# EAGLE design Suino board (EAGLE 7.4.0)
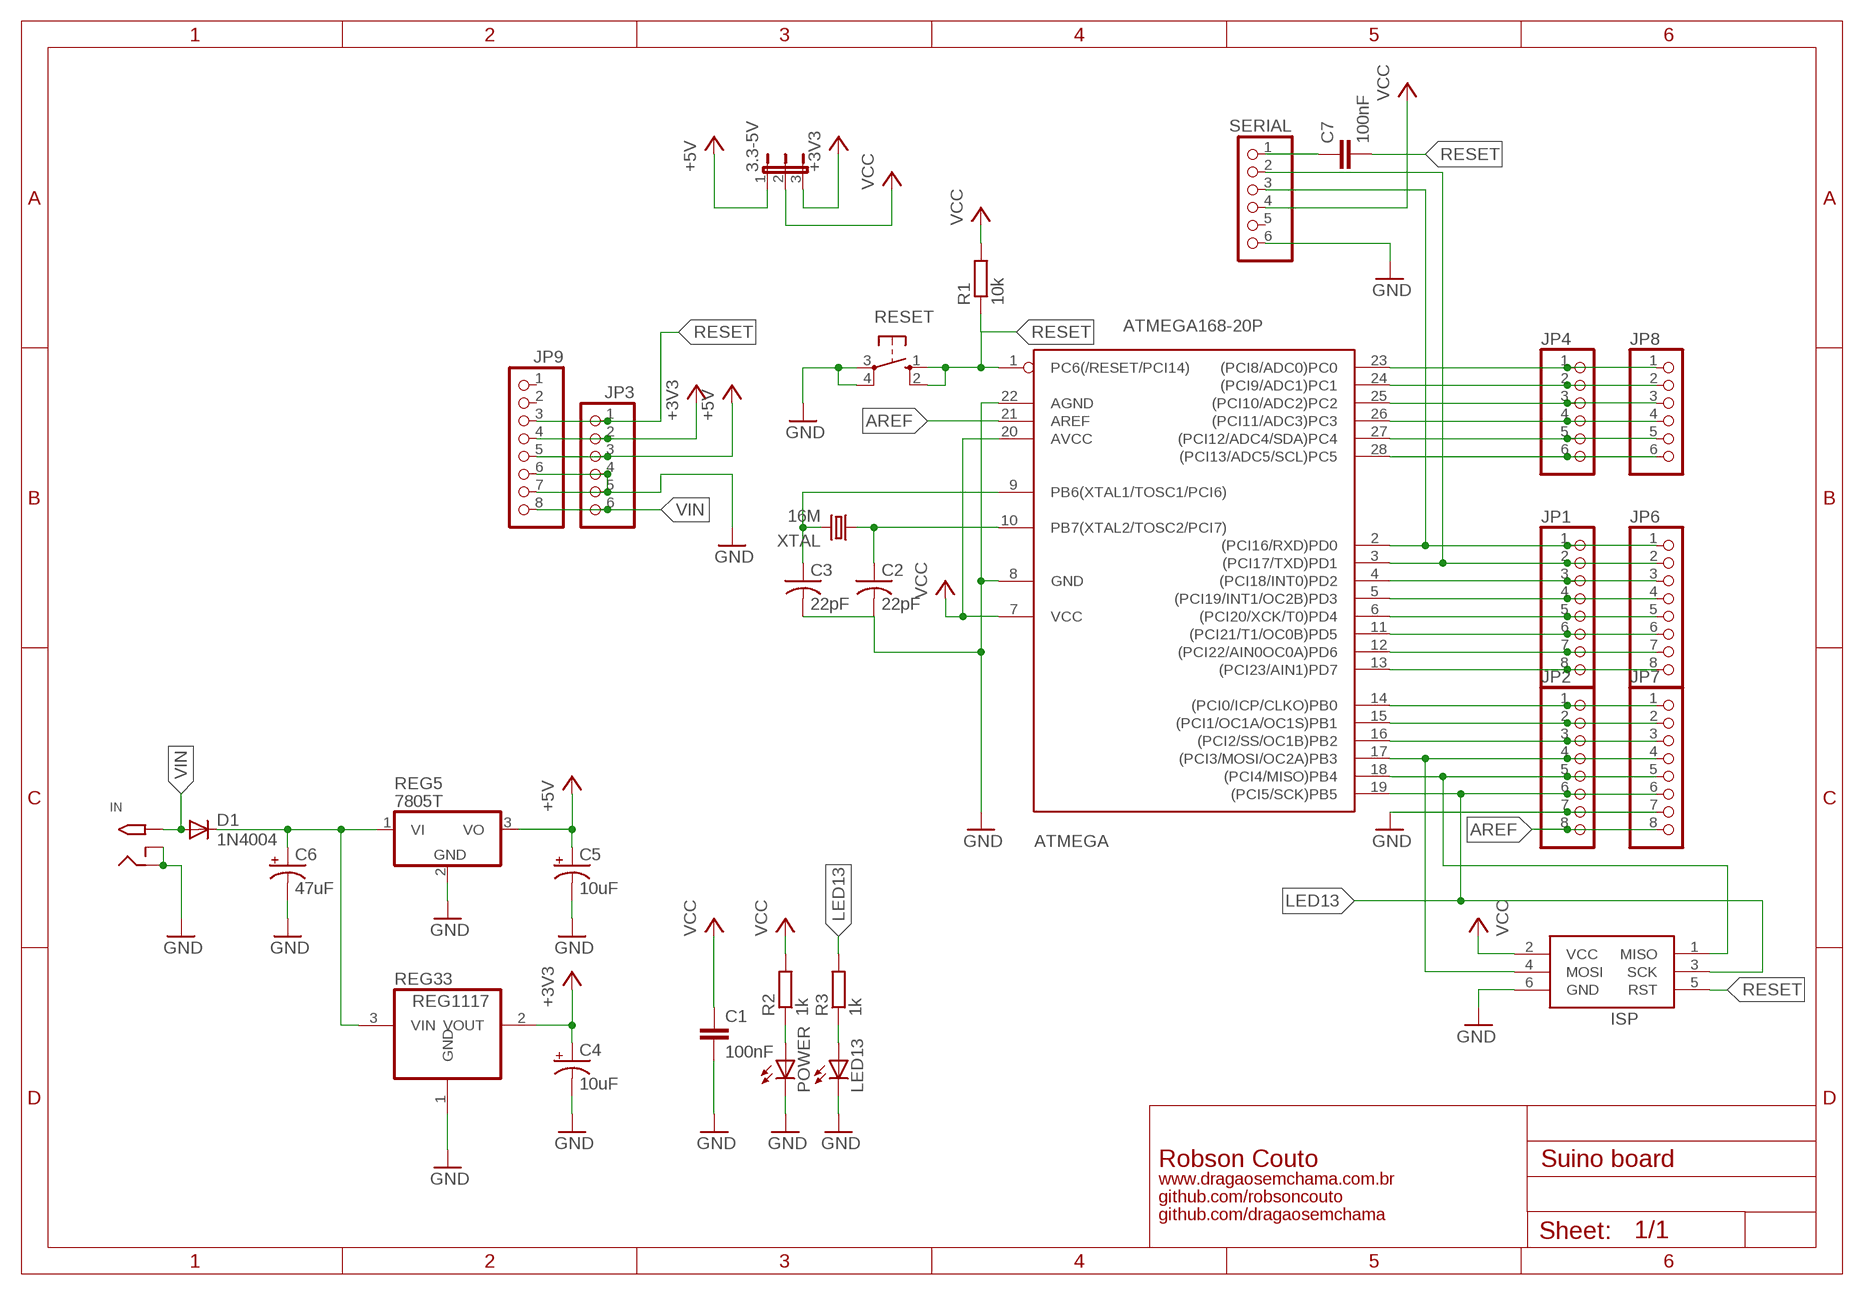
[diagram p0: schematic, sheet 1]

## Parts
3.3-5V  JP2E  [JP2]
ATMEGA  ATMEGA168-20P  [DIL28-3]
C1  100nF  C-EU050-025X075  [C050-025X075]
C2  22pF  C-US025-030X050  [C025-030X050]
C3  22pF  C-US025-030X050  [C025-030X050]
C4  10uF  CPOL-USE2.5-5  [E2,5-5]
C5  10uF  CPOL-USE2.5-5  [E2,5-5]
C6  47uF  CPOL-USE2.5-6  [E2,5-6]
C7  100nF  C-EU050-025X075  [C050-025X075]
D1  1N4004  [DO41-10]
IN  2.1MMJACKTHM  [PJ-102A]
ISP  AVRISP-6  [AVRISP]
JP1  PINHD-1X8BIG  [1X08-BIG]
JP2  PINHD-1X8BIG  [1X08-BIG]
JP3  PINHD-1X6B  [1X06-BIG]
JP4  PINHD-1X6B  [1X06-BIG]
JP6  PINHD-1X8BIG  [1X08-BIG]
JP7  PINHD-1X8BIG  [1X08-BIG]
JP8  PINHD-1X6B  [1X06-BIG]
JP9  PINHD-1X8BIG  [1X08-BIG]
LED13  LED3MM  [LED3MM]
POWER  LED3MM  [LED3MM]
R1  10k  R-EU_0207/7  [0207/7]
R2  1k  R-EU_0207/7  [0207/7]
R3  1k  R-EU_0207/7  [0207/7]
REG5  7805T  [TO220H]
REG33  REG1117  [SOT223]
RESET  10-XX  [B3F-10XX]
SERIAL  PINHD-1X6  [1X06]
XTAL  16M  CRYSTALHC49S  [HC49/S]

## Nets
+3V3: 3.3-5V.3 C4.+ JP3.2 JP9.4 REG33.2(VOUT)
+5V: 3.3-5V.1 C5.+ JP3.3 JP9.5 REG5.3(VO)
AREF: ATMEGA.21(AREF) JP2.8 JP7.8
GND: ATMEGA.8(GND) ATMEGA.22(AGND) C1.2 C2.2 C3.2 C4.- C5.- C6.- IN.RING IN.RING_SW ISP.6(GND) JP2.7 JP3.4 JP3.5 JP7.7 JP9.6 JP9.7 LED13.K(C) POWER.K(C) REG5.2(GND) REG33.1(GND) RESET.3(P) RESET.4(P1) SERIAL.6
LED13: ATMEGA.19((PCI5/SCK)PB5) ISP.3(SCK) JP2.6 JP7.6 R3.2
N$1: C7.1 SERIAL.1
N$2: ATMEGA.9(PB6(XTAL1/TOSC1/PCI6)) C3.1 XTAL.2
N$3: ATMEGA.10(PB7(XTAL2/TOSC2/PCI7)) C2.1 XTAL.1
N$5: POWER.A R2.1
N$6: LED13.A R3.1
N$7: ATMEGA.23((PCI8/ADC0)PC0) JP4.1 JP8.1
N$8: ATMEGA.24((PCI9/ADC1)PC1) JP4.2 JP8.2
N$9: ATMEGA.25((PCI10/ADC2)PC2) JP4.3 JP8.3
N$10: ATMEGA.26((PCI11/ADC3)PC3) JP4.4 JP8.4
N$11: ATMEGA.27((PCI12/ADC4/SDA)PC4) JP4.5 JP8.5
N$12: ATMEGA.28((PCI13/ADC5/SCL)PC5) JP4.6 JP8.6
N$13: ATMEGA.2((PCI16/RXD)PD0) JP1.1 JP6.1 SERIAL.3
N$14: ATMEGA.3((PCI17/TXD)PD1) JP1.2 JP6.2 SERIAL.2
N$15: ATMEGA.4((PCI18/INT0)PD2) JP1.3 JP6.3
N$16: ATMEGA.5((PCI19/INT1/OC2B)PD3) JP1.4 JP6.4
N$17: ATMEGA.6((PCI20/XCK/T0)PD4) JP1.5 JP6.5
N$18: ATMEGA.11((PCI21/T1/OC0B)PD5) JP1.6 JP6.6
N$19: ATMEGA.12((PCI22/AIN0OC0A)PD6) JP1.7 JP6.7
N$20: ATMEGA.13((PCI23/AIN1)PD7) JP1.8 JP6.8
N$21: ATMEGA.14((PCI0/ICP/CLKO)PB0) JP2.1 JP7.1
N$22: ATMEGA.15((PCI1/OC1A/OC1S)PB1) JP2.2 JP7.2
N$23: ATMEGA.16((PCI2/SS/OC1B)PB2) JP2.3 JP7.3
N$24: ATMEGA.17((PCI3/MOSI/OC2A)PB3) ISP.4(MOSI) JP2.4 JP7.4
N$25: ATMEGA.18((PCI4/MISO)PB4) ISP.1(MISO) JP2.5 JP7.5
RESET: ATMEGA.1(PC6(/RESET/PCI14)) C7.2 ISP.5(RST) JP3.1 JP9.3 R1.1 RESET.1(S) RESET.2(S1)
VCC: 3.3-5V.2 ATMEGA.7(VCC) ATMEGA.20(AVCC) C1.1 ISP.2(VCC) R1.2 R2.2 SERIAL.4
VD: C6.+ D1.C REG5.1(VI) REG33.3(VIN)
VIN: D1.A IN.TIP JP3.6 JP9.8
Unconnected: JP9.1 JP9.2 SERIAL.5

## Notes on the sheet
- Robson Couto
- www.dragaosemchama.com.br
- github.com/robsoncouto
- github.com/dragaosemchama

## Library data of the parts
3.3-5V = jumper:JP2E: JUMPER
ATMEGA = adafruit:ATMEGA168*P: MICROCONTROLLER 16 kBytes FLASH 1 kBytes SRAM 512 Bytes EEPROM USART 8-channel 10 bit ADC
C1 C7 = resistor:C-EU: CAPACITOR, European symbol
C2 C3 = adafruit:C-US: CAPACITOR, American symbol
C4-C6 = resistor:CPOL-US: POLARIZED CAPACITOR, American symbol
D1 = diode:1N4004: DIODE general purpose rectifier, 1 A
IN = adafruit:2.1MMJACK: 2.1mm x 5.5mm THM DC jack with internal switch. Digikey part #PJ-102A, 4UCON part #05537 2.1mm x 5.5mm SMT DC jack with internal switch. Digikey part #PJ-002A-SMT, 4UCON part #03267 By microbuilder.eu & adafruit.com
ISP = adafruit:AVRISP: AVR ISP HEADER Standard 6 pin header for AVR programming
JP1 JP2 JP6 JP7 JP9 = adafruit:PINHD-1X8: PIN HEADER
JP3 JP4 JP8 SERIAL = adafruit:PINHD-1X6: PIN HEADER
LED13 POWER = adafruit:LED: LED OSRAM: - CHIPLED LG R971, LG N971, LY N971, LG Q971, LY Q971, LO R971, LY R971 LH N974, LH R974 LS Q976, LO Q976, LY Q976 LO Q996 - Hyper CHIPLED LW Q18S LB Q993, LB Q99A, LB R99A - SideLED LS A670, LO A670, LY A670, LG A670, LP A670 LB A673, LV A673, LT A673, LW A673 LH A674 LY A675 LS A676, LA A676, LO A676, LY A676, LW A676 LS A679, LY A679, LG A679 - Hyper Micro SIDELED® LS Y876, LA Y876, LO Y876, LY Y876 LT Y87S - SmartLED LW L88C, LW L88S LB L89C, LB L89S, LG L890 LS L89K, LO L89K, LY L89K LS L896, LA L896, LO L896, LY L896 - TOPLED LS T670, LO T670, LY T670, LG T670, LP T670 LSG T670, LSP T670, LSY T670, LOP T670, LYG T670 LG T671, LOG T671, LSG T671 LB T673, LV T673, LT T673, LW T673 LH T674 LS T676, LA T676, LO T676, LY T676, LB T676, LH T676, LSB T676, LW T676 LB T67C, LV T67C, LT T67C, LS T67K, LO T67K, LY T67K, LW E67C LS E67B, LA E67B, LO E67B, LY E67B, LB E67C, LV E67C, LT E67C LW T67C LS T679, LY T679, LG T679 LS T770, LO T770, LY T770, LG T770, LP T770 LB T773, LV T773, LT T773, LW T773 LH T774 LS E675, LA E675, LY E675, LS T675 LS T776, LA T776, LO T776, LY T776, LB T776 LHGB T686 LT T68C, LB T68C - Hyper Mini TOPLED® LB M676 - Mini TOPLED Santana® LG M470 LS M47K, LO M47K, LY M47K Source: http://www.osram.convergy.de/
R1-R3 = rcl:R-EU_: RESISTOR, European symbol
REG5 = adafruit:78*: Positive VOLTAGE REGULATOR Added bigger pads to the TO-92 package
REG33 = burr-brown:REG1117: 800mA and 1A Low Dropout (LDO) Positive Regulator 1.8V, 2.5V, 2.85V, 3.3V, 5V, and Adj; MPN: REG1117; OC_FARNELL: 1097566; OC_NEWARK: 14P6981
RESET = switch-omron:10-XX: OMRON SWITCH; MPN: B3F-1000; OC_FARNELL: 176432; OC_NEWARK: 36M3542
XTAL = adafruit:CRYSTAL: CRYSTAL; OC_FARNELL: 1667008; OC_NEWARK: unknown

## Board
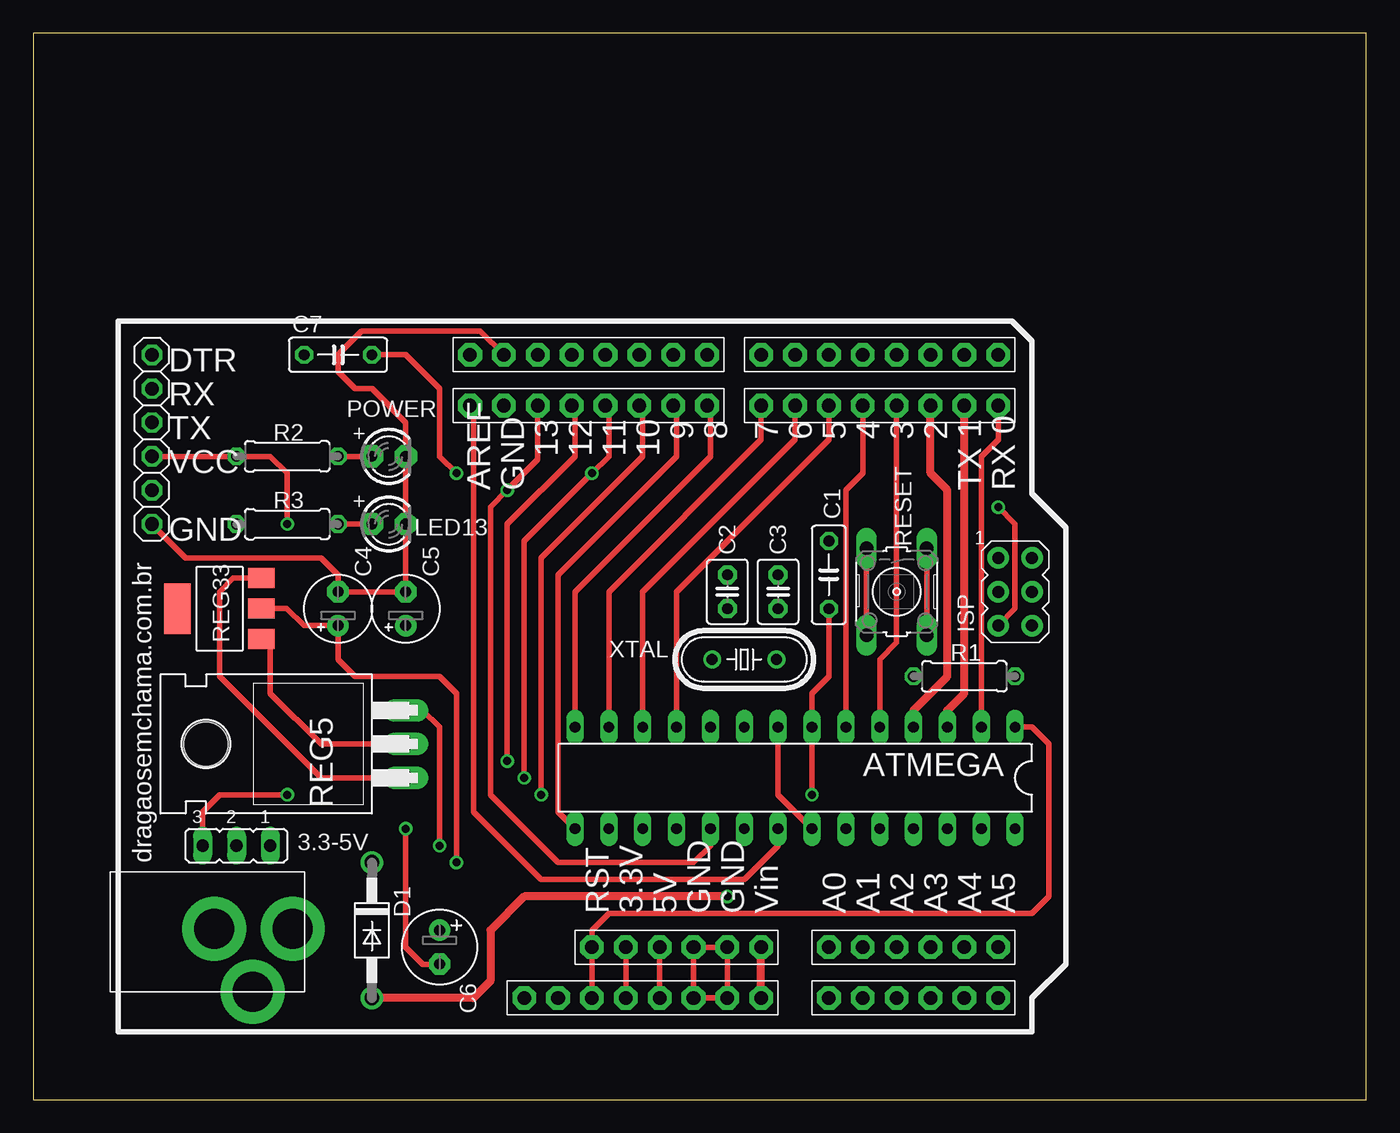
[diagram p1: board, top side]
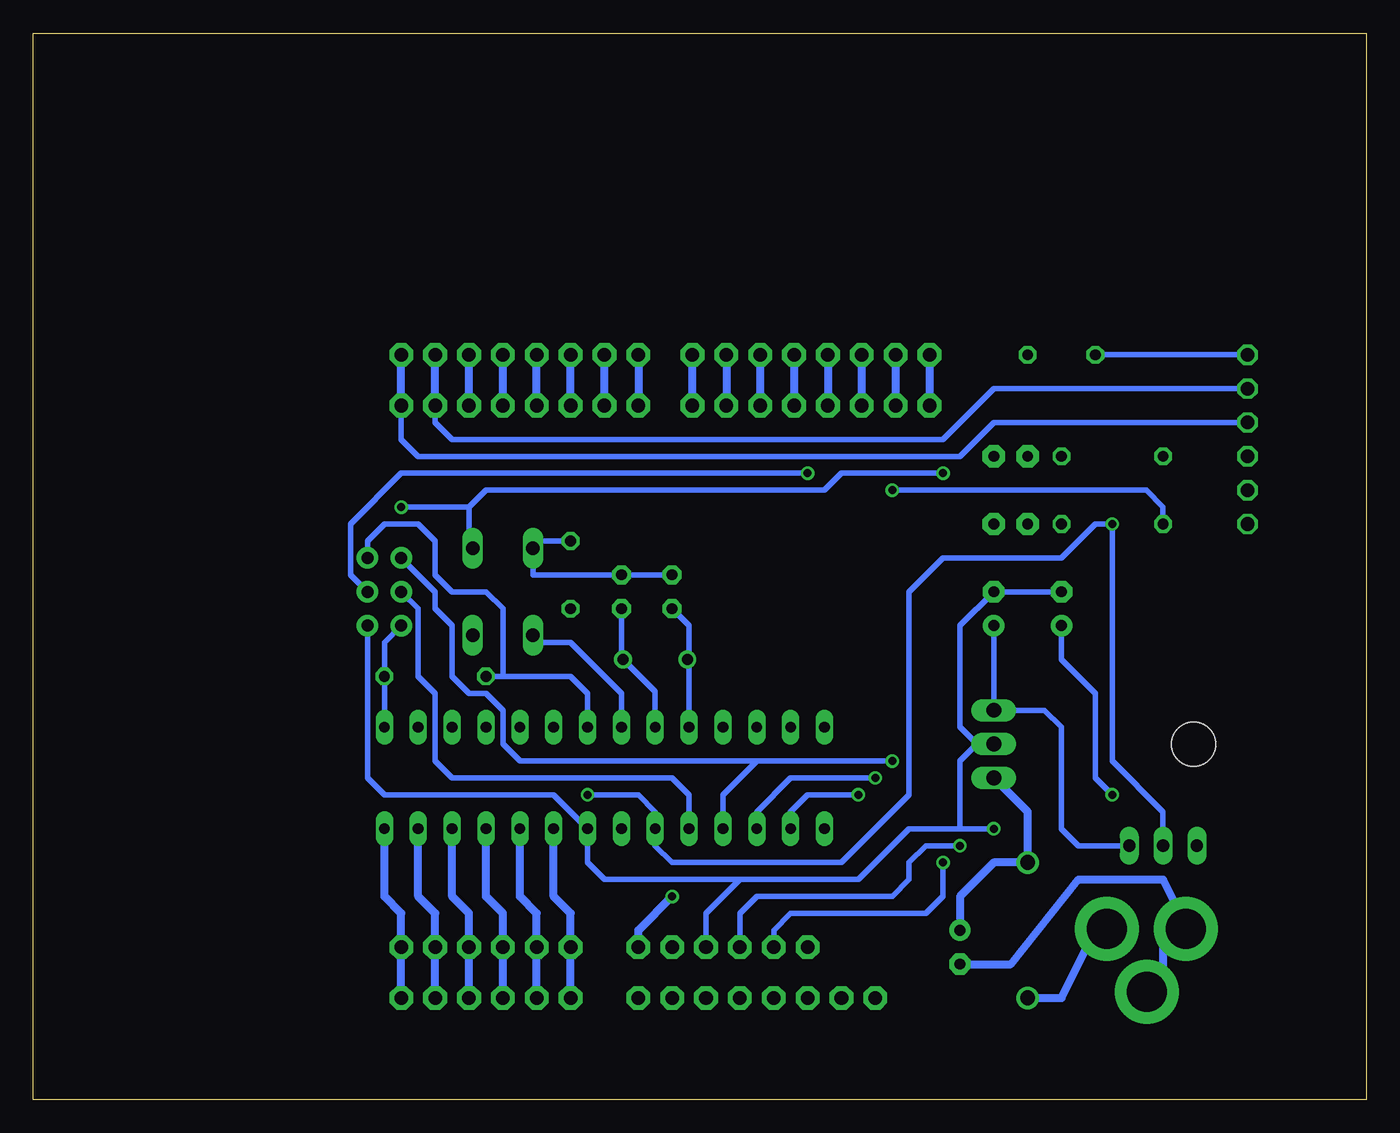
[diagram p2: board, bottom side, seen from below]

Size 100 x 80 mm. Coordinates in mm from the lower left corner, seen from the top.
Outline: 0,0 100,0 100,80 0,80 0,0
Copper layers (1*16): Top 0.035mm / dielectric 1.5mm / Bottom 0.035mm
Design rules "default *": minimum track width 10mil, minimum drill 16mil, track to track 8mil, track to pad 8mil, pad to pad 8mil, via to via 8mil, smd to smd 8mil, copper to edge 40mil, drill to drill 8mil, minimum pad ring 10mil, minimum via ring 8mil, stop-mask expansion 4mil, vias tented up to drill 0mil, thermal gap 10mil

### Footprints (pad centres in the part's own frame; a part is rotated, then mirrored left to right if it is on the bottom)
JP2 = drill 0.914 long: 1 -2.54,0; 2 0,0; 3 2.54,0
DIL28-3 = drill 0.813 long: 1 -16.51,-3.81; 2 -13.97,-3.81; 3 -11.43,-3.81; 4 -8.89,-3.81; 5 -6.35,-3.81; 6 -3.81,-3.81; 7 -1.27,-3.81; 8 1.27,-3.81; 9 3.81,-3.81; 10 6.35,-3.81; 11 8.89,-3.81; 12 11.43,-3.81; 13 13.97,-3.81; 14 16.51,-3.81; 15 16.51,3.81; 16 13.97,3.81; 17 11.43,3.81; 18 8.89,3.81; 19 6.35,3.81; 20 3.81,3.81; 21 1.27,3.81; 22 -1.27,3.81; 23 -3.81,3.81; 24 -6.35,3.81; 25 -8.89,3.81; 26 -11.43,3.81; 27 -13.97,3.81; 28 -16.51,3.81
C050-025X075 = drill 0.813 octagon: 1 -2.54,0; 2 2.54,0
C025-030X050 = drill 0.813 pad 1.422 octagon: 1 -1.27,0; 2 1.27,0
E2,5-5 = drill 0.813 pad 1.6: + -1.27,0 | drill 0.813 pad 1.6 octagon: - 1.27,0
E2,5-6 = drill 0.813 pad 1.6: + -1.27,0 | drill 0.813 pad 1.6 octagon: - 1.27,0
DO41-10 = drill 1.118: A 5.08,0; C -5.08,0
PJ-102A = drill 3 pad 4.8: RING 0.1,-3.39; RING_SW -4.6,-6.29; TIP 0.1,-9.29
AVRISP = drill 0.9 pad 1.626: 1 -1.27,2.54; 2 1.27,2.54; 3 -1.27,0; 4 1.27,0; 5 -1.27,-2.54; 6 1.27,-2.54
1X08-BIG = drill 1.016 pad 1.778 octagon: 1 -8.89,0; 2 -6.35,0; 3 -3.81,0; 4 -1.27,0; 5 1.27,0; 6 3.81,0; 7 6.35,0; 8 8.89,0
1X06-BIG = drill 1.016 pad 1.778 octagon: 1 -6.35,0; 2 -3.81,0; 3 -1.27,0; 4 1.27,0; 5 3.81,0; 6 6.35,0
LED3MM = drill 0.813 pad 1.676 octagon: A -1.27,0; K 1.27,0
0207/7 = drill 0.813 octagon: 1 -3.81,0; 2 3.81,0
TO220H = drill 1.118 long: 1 -2.54,-10.16; 2 0,-10.16; 3 2.54,-10.16 | hole 3.302: 0,4.826
SOT223 = smd 1.499 x 2.007: 1 -2.261,-3.15; 2 0.025,-3.15; 3 2.311,-3.15 | smd 3.81 x 2.007: 4 0,3.15
B3F-10XX = drill 1.016 long: 1 -3.251,2.261; 2 3.251,2.261; 3 -3.251,-2.261; 4 3.251,-2.261
1X06 = drill 1.016 octagon: 1 -6.35,0; 2 -3.81,0; 3 -1.27,0; 4 1.27,0; 5 3.81,0; 6 6.35,0
HC49/S = drill 0.813: 1 -2.413,0; 2 2.413,0

### Placement (x,y rotation side)
3.3-5V  15.24,19.05 180 top
ATMEGA  57.15,24.13 180 top
C1  59.69,39.37 90 top
C2  52.07,38.1 90 top
C3  55.88,38.1 90 top
C4  22.86,36.83 90 top
C5  27.94,36.83 90 top
C6  30.48,11.43 270 top
C7  22.86,55.88 0 top
D1  25.4,12.7 270 top
IN  10.16,12.7 90 top
ISP  73.66,38.1 0 top
JP1  63.5,55.88 180 top
JP2  41.66,55.88 180 top
JP3  48.26,11.43 0 top
JP4  66.04,11.43 0 top
JP6  63.5,52.07 180 top
JP7  41.66,52.07 180 top
JP8  66.04,7.62 0 top
JP9  45.72,7.62 0 top
LED13  26.67,43.18 0 top
POWER  26.67,48.26 0 top
R1  69.85,31.75 180 top
R2  19.05,48.26 180 top
R3  19.05,43.18 180 top
REG5  17.78,26.67 90 top
REG33  13.97,36.83 90 top
RESET  64.77,38.1 270 top
SERIAL  8.89,49.53 270 top
XTAL  53.34,33.02 0 top

### Tracks (layer width: path | path; a pad name or v marks a point on that pad's centre or on a via)
+3V3  (via drill 0.6)
  Top 0.406: JP9.4 JP3.2 | v31.75,17.78 31.75,30.48 30.48,31.75 24.13,31.75 22.86,33.02 C4.+ 20.32,35.56 19.02,36.85 REG33.2 | 3.3-5V.3 12.7,21.59 13.97,22.86 v19.05,22.86
  Bottom 0.406: JP3.2 44.45,12.7 43.18,13.97 33.02,13.97 31.75,15.24 v31.75,17.78 | v19.05,22.86 20.32,24.13 20.32,30.48 22.86,33.02 C4.+
+5V  (via drill 0.6)
  Top 0.406: JP9.5 JP3.3 | v30.48,19.05 30.48,27.94 29.21,29.21 REG5.3
  Bottom 0.406: C5.+ REG5.3 24.13,29.21 22.86,27.94 22.86,20.32 21.59,19.05 3.3-5V.1 | JP3.3 46.99,13.97 45.72,15.24 35.56,15.24 34.29,16.51 34.29,17.78 33.02,19.05 v30.48,19.05
AREF
  Top 0.406: ATMEGA.21 55.88,19.05 53.34,16.51 38.1,16.51 33.02,21.59 33.02,51.82 JP7.8
  Bottom 0.61: JP2.8 JP7.8
GND  (via drill 0.6)
  Top 0.406: SERIAL.6 11.43,40.64 21.59,40.64 22.86,39.37 C4.- C5.- LED13.K POWER.K 27.94,50.8 25.4,53.34 24.13,53.34 22.86,54.61 22.86,55.88 24.64,57.66 33.53,57.66 JP2.7 | RESET.4 RESET.3 | ATMEGA.8 55.88,22.86 ATMEGA.22 | v27.94,20.32 27.94,11.43 29.21,10.16 C6.- | REG5.2 21.59,26.67 17.78,30.48 17.78,33.91 REG33.1 | JP9.7 JP3.5 JP3.4 JP9.6 JP9.7
  Bottom 0.406: C2.2 C3.2 62.51,39.37 RESET.3 61.95,41.91 C1.2 | ISP.6 74.93,24.13 73.66,22.86 60.96,22.86 ATMEGA.22 58.42,17.78 57.15,16.51 46.99,16.51 | JP3.4 49.53,13.97 46.99,16.51 | 46.99,16.51 38.1,16.51 34.29,20.32 30.48,20.32 | REG5.2 29.21,26.67 | 29.21,26.67 30.48,25.4 30.48,20.32 | C4.- C5.- 30.48,35.56 30.48,27.94 29.21,26.67 | ATMEGA.8 55.88,30.48 59.69,34.29 61.95,34.29 RESET.4 | 30.48,20.32 v27.94,20.32
  Bottom 0.61: JP2.7 JP7.7 | IN.RING_SW 15.24,8.89 15.24,12.7 IN.RING 13.97,13.97 15.24,16.51 21.59,16.51 26.67,10.16 C6.-
LED13  (via drill 0.6)
  Top 0.406: JP7.6 37.85,48.01 v35.56,45.72 34.29,44.45 34.29,22.86 39.37,17.78 49.53,17.78 50.8,19.05 ATMEGA.19
  Bottom 0.406: v35.56,45.72 16.51,45.72 15.24,44.45 R3.2 | ISP.3 71.12,36.83 71.12,31.75 69.85,30.48 69.85,25.4 68.58,24.13 52.07,24.13 50.8,22.86 ATMEGA.19
  Bottom 0.61: JP7.6 JP2.6
N$1
  Bottom 0.406: SERIAL.1 C7.1
N$2
  Bottom 0.406: ATMEGA.9 53.34,30.61 XTAL.2 55.88,33.15 C3.1
N$3
  Bottom 0.406: ATMEGA.10 50.8,32.89 XTAL.1 50.8,33.02 50.8,35.56 C2.1
N$5
  Top 0.406: R2.1 POWER.A
N$6
  Top 0.406: LED13.A R3.1
N$7
  Bottom 0.61: JP8.1 JP4.1 59.69,13.97 60.96,15.24 ATMEGA.23
N$8
  Bottom 0.61: JP8.2 JP4.2 62.23,13.97 63.5,15.24 ATMEGA.24
N$9
  Bottom 0.61: JP8.3 JP4.3 64.77,13.97 66.04,15.24 ATMEGA.25
N$10
  Bottom 0.61: JP8.4 JP4.4 67.31,13.97 68.58,15.24 ATMEGA.26
N$11
  Bottom 0.61: JP8.5 JP4.5 69.85,13.97 71.12,15.24 ATMEGA.27
N$12
  Bottom 0.61: JP8.6 JP4.6 72.39,13.97 73.66,15.24 ATMEGA.28
N$13
  Top 0.406: ATMEGA.2 71.12,48.26 72.39,49.53 JP6.1
  Bottom 0.406: SERIAL.3 27.94,50.8 30.48,48.26 71.12,48.26 72.39,49.53 JP6.1
  Bottom 0.61: JP6.1 JP1.1
N$14
  Top 0.61: ATMEGA.3 68.58,29.21 69.85,30.48 JP6.2
  Bottom 0.406: SERIAL.2 27.94,53.34 31.75,49.53 68.58,49.53 69.85,50.8 JP6.2
  Bottom 0.61: JP6.2 JP1.2
N$15
  Top 0.61: ATMEGA.4 66.04,29.21 68.58,31.75 68.58,45.72 67.31,46.99 JP6.3
  Bottom 0.61: JP6.3 JP1.3
N$16
  Top 0.406: ATMEGA.5 63.5,33.02 64.77,34.29 JP6.4
  Bottom 0.61: JP6.4 JP1.4
N$17
  Top 0.406: JP6.5 62.23,46.99 60.96,45.72 ATMEGA.6
  Bottom 0.61: JP6.5 JP1.5
N$18
  Top 0.406: ATMEGA.11 48.26,38.1 59.69,49.53 JP6.6
  Bottom 0.61: JP6.6 JP1.6
N$19
  Top 0.406: ATMEGA.12 45.72,38.1 57.15,49.53 JP6.7
  Bottom 0.61: JP6.7 JP1.7
N$20
  Top 0.406: ATMEGA.13 43.18,38.1 54.61,49.53 JP6.8
  Bottom 0.61: JP1.8 JP6.8
N$21
  Top 0.406: ATMEGA.14 40.64,38.1 50.8,48.26 50.8,51.82 JP7.1
  Bottom 0.61: JP7.1 JP2.1
N$22
  Top 0.406: ATMEGA.15 39.37,21.59 39.37,39.37 48.26,48.26 48.26,51.82 JP7.2
  Bottom 0.61: JP2.2 JP7.2
N$23  (via drill 0.6)
  Top 0.406: v38.1,22.86 38.1,40.64 45.72,48.26 45.72,51.82 JP7.3
  Bottom 0.406: ATMEGA.16 43.18,21.59 41.91,22.86 v38.1,22.86
  Bottom 0.61: JP2.3 JP7.3
N$24  (via drill 0.6)
  Top 0.406: v36.83,24.13 36.83,41.91 v41.91,46.99 43.18,48.26 43.18,51.82 JP7.4
  Bottom 0.406: ATMEGA.17 45.72,21.59 43.18,24.13 v36.83,24.13 | ISP.4 76.2,39.37 76.2,43.18 72.39,46.99 v41.91,46.99
  Bottom 0.61: JP2.4 JP7.4
N$25  (via drill 0.6)
  Top 0.406: v35.56,25.4 35.56,43.18 40.64,48.26 40.64,51.82 JP7.5
  Bottom 0.406: ATMEGA.18 48.26,22.86 45.72,25.4 v35.56,25.4 63.5,25.4 64.77,26.67 64.77,29.21 66.04,30.48 67.31,30.48 68.58,31.75 68.58,35.56 69.85,36.83 69.85,38.1 ISP.1
  Bottom 0.61: JP2.5 JP7.5
RESET  (via drill 0.6)
  Top 0.406: JP9.3 JP3.1 41.91,12.7 43.18,13.97 74.93,13.97 76.2,15.24 76.2,26.67 74.93,27.94 ATMEGA.1 | RESET.1 RESET.2 | ISP.5 73.66,36.83 73.66,43.18 v72.39,44.45 | C7.2 27.94,55.88 30.48,53.34 30.48,48.26 v31.75,46.99
  Bottom 0.406: ATMEGA.1 R1.1 73.66,34.29 ISP.5 | v31.75,46.99 39.37,46.99 40.64,45.72 66.04,45.72 67.31,44.45 | 67.31,44.45 67.31,41.63 RESET.1 | v72.39,44.45 67.31,44.45
VCC  (via drill 0.6)
  Top 0.406: SERIAL.4 R2.2 17.78,48.26 19.05,46.99 v19.05,43.18 | v58.42,22.86 ATMEGA.7 58.42,30.48 59.69,31.75 C1.1
  Bottom 0.406: R1.2 64.77,31.75 | 64.77,31.75 59.69,31.75 58.42,30.48 ATMEGA.7 | ISP.2 74.93,41.91 73.66,43.18 71.12,43.18 69.85,41.91 69.85,39.37 68.58,38.1 66.04,38.1 64.77,36.83 64.77,31.75 | 3.3-5V.2 15.24,21.59 19.05,25.4 v19.05,43.18 20.32,43.18 22.86,40.64 31.75,40.64 34.29,38.1 34.29,22.86 39.37,17.78 52.07,17.78 53.34,19.05 ATMEGA.20 53.34,21.59 54.61,22.86 v58.42,22.86
VD
  Top 0.406: REG33.3 15.01,39.14 13.97,38.1 13.97,31.75 21.59,24.13 REG5.1
  Bottom 0.61: C6.+ 30.48,15.24 27.94,17.78 D1.C 25.4,21.59 REG5.1
VIN  (via drill 0.6)
  Top 0.61: D1.A 33.02,7.62 34.29,8.89 34.29,12.7 36.83,15.24 v52.07,15.24 | JP9.8 JP3.6
  Bottom 0.61: D1.A 22.86,7.62 20.32,12.7 IN.TIP | v52.07,15.24 54.61,12.7 JP3.6

### Text on the board
tNames: DTR | RX | TX | 9 | 8 | 7 | 6 | 5 | 4 | 3 | 2 | 13 | 12 | 11 | 10 | VCC | AREF | GND | TX 1 | RX 0 | GND | dragaosemchama.com.br | RST | 3.3V | 5V | GND | GND | Vin | A0 | A1 | A2 | A3 | A4 | A5